# Altium schematic sheet 9 Microphone Input.SchDoc
size B; DocumentNumber: 9; SheetNumber: 9; SheetTotal: 17
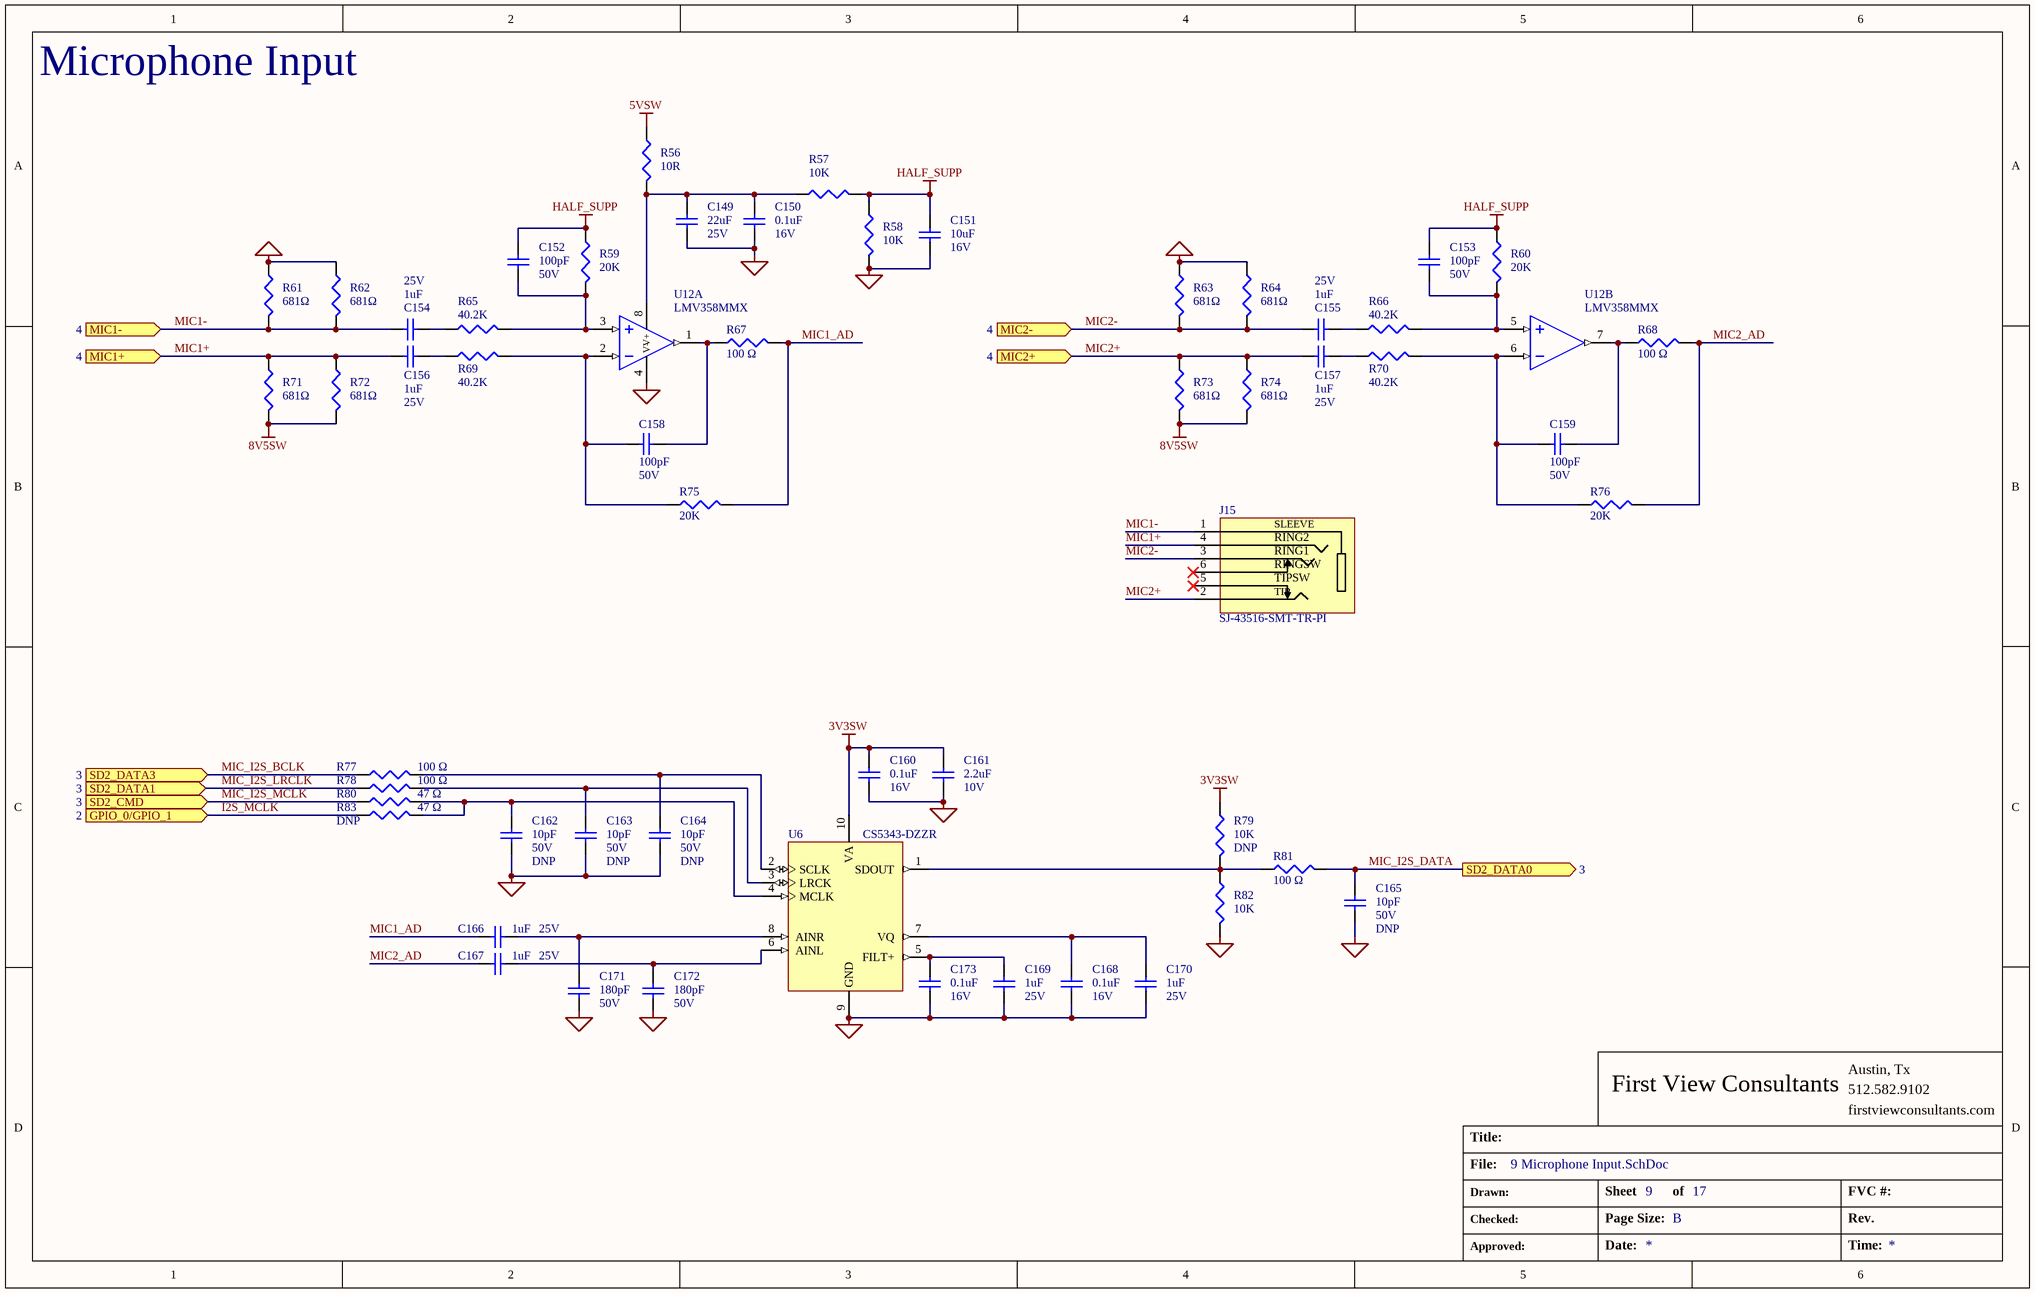
[diagram p0: 9 Microphone Input.SchDoc]

## Parts
C149  value 22uF  Voltage: 25V  [CAP_0805]  (hidden comment: Cap 22uF 25V 0805)
C150  value 0.1uF  Voltage: 16V  [CAP_0402]  (hidden comment: Cap 0.1uF 16V 0402)
C151  value 10uF  Voltage: 16V  [CAP_0603]  (hidden comment: Cap 10uF 16V 0603)
C152  value 100pF  Voltage: 50V  [CAP_0402]  (hidden comment: Cap 100pF 50V 0402)
C153  value 100pF  Voltage: 50V  [CAP_0402]  (hidden comment: Cap 100pF 50V 0402)
C154  value 1uF  Voltage: 25V  [CAP_0402]  (hidden comment: Cap 1uF 25V 0402)
C155  value 1uF  Voltage: 25V  [CAP_0402]  (hidden comment: Cap 1uF 25V 0402)
C156  value 1uF  Voltage: 25V  [CAP_0402]  (hidden comment: Cap 1uF 25V 0402)
C157  value 1uF  Voltage: 25V  [CAP_0402]  (hidden comment: Cap 1uF 25V 0402)
C158  value 100pF  Voltage: 50V  [CAP_0402]  (hidden comment: Cap 100pF 50V 0402)
C159  value 100pF  Voltage: 50V  [CAP_0402]  (hidden comment: Cap 100pF 50V 0402)
C160  value 0.1uF  Voltage: 16V  [CAP_0402]  (hidden comment: Cap 0.1uF 16V 0402)
C161  value 2.2uF  Voltage: 10V  [CAP_0402]  (hidden comment: Cap 2.2uF 10V 0402)
C162  value 10pF  Voltage: 50V  [CAP_0402]  (hidden comment: Cap 10pF 50V 0402)
C163  value 10pF  Voltage: 50V  [CAP_0402]  (hidden comment: Cap 10pF 50V 0402)
C164  value 10pF  Voltage: 50V  [CAP_0402]  (hidden comment: Cap 10pF 50V 0402)
C165  value 10pF  Voltage: 50V  [CAP_0402]  (hidden comment: Cap 10pF 50V 0402)
C166  value 1uF  Voltage: 25V  [CAP_0402]  (hidden comment: Cap 1uF 25V 0402)
C167  value 1uF  Voltage: 25V  [CAP_0402]  (hidden comment: Cap 1uF 25V 0402)
C168  value 0.1uF  Voltage: 16V  [CAP_0402]  (hidden comment: Cap 0.1uF 16V 0402)
C169  value 1uF  Voltage: 25V  [CAP_0402]  (hidden comment: Cap 1uF 25V 0402)
C170  value 1uF  Voltage: 25V  [CAP_0402]  (hidden comment: Cap 1uF 25V 0402)
C171  value 180pF  Voltage: 50V  [CAP_0402]  (hidden comment: Cap 180pF 50V 0402)
C172  value 180pF  Voltage: 50V  [CAP_0402]  (hidden comment: Cap 180pF 50V 0402)
C173  value 0.1uF  Voltage: 16V  [CAP_0402]  (hidden comment: Cap 0.1uF 16V 0402)
J15  SJ-43516-SMT-TR-PI  [CON_SJ-43516-SMT]
R56  value 10R  [RES_0402]  (hidden comment: Res 10R 0.1W)
R57  value 10K  [RES_0402]  (hidden comment: Res 10K 0.063W)
R58  value 10K  [RES_0402]  (hidden comment: Res 10K 0.063W)
R59  value 20K  [RES_0402]  (hidden comment: Res 20K 0.1W)
R60  value 20K  [RES_0402]  (hidden comment: Res 20K 0.1W)
R61  value 681Ω  [RES_1210]  (hidden comment: Res 681R 0.5W)
R62  value 681Ω  [RES_1210]  (hidden comment: Res 681R 0.5W)
R63  value 681Ω  [RES_1210]  (hidden comment: Res 681R 0.5W)
R64  value 681Ω  [RES_1210]  (hidden comment: Res 681R 0.5W)
R65  value 40.2K  [RES_0402]  (hidden comment: Res 40.2K 0.1W)
R66  value 40.2K  [RES_0402]  (hidden comment: Res 40.2K 0.1W)
R67  value 100 Ω  [RES_0402]  (hidden comment: Res 100R 0.063W)
R68  value 100 Ω  [RES_0402]  (hidden comment: Res 100R 0.063W)
R69  value 40.2K  [RES_0402]  (hidden comment: Res 40.2K 0.1W)
R70  value 40.2K  [RES_0402]  (hidden comment: Res 40.2K 0.1W)
R71  value 681Ω  [RES_1210]  (hidden comment: Res 681R 0.5W)
R72  value 681Ω  [RES_1210]  (hidden comment: Res 681R 0.5W)
R73  value 681Ω  [RES_1210]  (hidden comment: Res 681R 0.5W)
R74  value 681Ω  [RES_1210]  (hidden comment: Res 681R 0.5W)
R75  value 20K  [RES_0402]  (hidden comment: Res 20K 0.1W)
R76  value 20K  [RES_0402]  (hidden comment: Res 20K 0.1W)
R77  value 100 Ω  [RES_0402]  (hidden comment: Res 100R 0.063W)
R78  value 100 Ω  [RES_0402]  (hidden comment: Res 100R 0.063W)
R79  value 10K  [RES_0402]  (hidden comment: Res 10K 0.063W)
R80  value 47 Ω  [RES_0402]  (hidden comment: Res 47R 0.063W)
R81  value 100 Ω  [RES_0402]  (hidden comment: Res 100R 0.063W)
R82  value 10K  [RES_0402]  (hidden comment: Res 10K 0.063W)
R83  value 47 Ω  [RES_0402]  (hidden comment: Res 47R 0.063W)
U6  CS5343-DZZR  [TSSOP-10_CS5343]
U12  LMV358MMX  [VSSOP-8_LMV358MMX]  (parts A,B of 2)

## Ports
GPIO_0/GPIO_1 (in, see 2), MIC1+ (in, see 4), MIC1- (in, see 4), MIC2+ (in, see 4), MIC2- (in, see 4), SD2_CMD (in, see 3), SD2_DATA0 (out, see 3), SD2_DATA1 (in, see 3), SD2_DATA3 (in, see 3)

## Nets
3V3SW: C160.1 C161.1 R79.1 U6.10(VA)
5VSW: R56.1
8V5SW: R71.2 R72.2 R73.2 R74.2
GND: C149.2 C150.2 C151.2 C160.2 C161.2 C162.2 C163.2 C164.2 C165.2 C168.2 C169.2 C170.2 C171.2 C172.2 C173.2 R58.2 R61.1 R62.1 R63.1 R64.1 R82.2 U6.9(GND) U12.4(V-)
HALF_SUPP: C151.1 C152.1 C153.1 R57.2 R58.1 R59.1 R60.1
I2S_MCLK: R83.1 ; port GPIO_0/GPIO_1
MIC1+: C156.1 J15.4(RING_2) R71.1 R72.1 ; port MIC1+
MIC1-: C154.1 J15.1(SLEEVE) R61.2 R62.2 ; port MIC1-
MIC1_AD: C166.1 R67.2 R75.2
MIC2+: C157.1 J15.2(TIP) R73.1 R74.1 ; port MIC2+
MIC2-: C155.1 J15.3(RING_1) R63.2 R64.2 ; port MIC2-
MIC2_AD: C167.1 R68.2 R76.2
MIC_I2S_BCLK: R77.1 ; port SD2_DATA3
MIC_I2S_DATA: C165.1 R81.2 ; port SD2_DATA0
MIC_I2S_LRCLK: R78.1 ; port SD2_DATA1
MIC_I2S_MCLK: R80.1 ; port SD2_CMD
NetC149_1: C149.1 C150.1 R56.2 R57.1 U12.8(V+)
NetC152_2: C152.2 R59.2 R65.2 U12.3(INA+)
NetC153_2: C153.2 R60.2 R66.2 U12.5(INB+)
NetC154_2: C154.2 R65.1
NetC155_2: C155.2 R66.1
NetC156_2: C156.2 R69.1
NetC157_2: C157.2 R70.1
NetC158_1: C158.1 R69.2 R75.1 U12.2(INA-)
NetC158_2: C158.2 R67.1 U12.1(OUTA)
NetC159_1: C159.1 R70.2 R76.1 U12.6(INB-)
NetC159_2: C159.2 R68.1 U12.7(OUTB)
NetC162_1: C162.1 R80.2 R83.2 U6.4(MCLK)
NetC163_1: C163.1 R78.2 U6.3(LRCK)
NetC164_1: C164.1 R77.2 U6.2(SCLK)
NetC166_2: C166.2 C171.1 U6.8(AINR)
NetC167_2: C167.2 C172.1 U6.6(AINL)
NetC168_1: C168.1 C170.1 U6.7(VQ)
NetC169_1: C169.1 C173.1 U6.5(FILT+)
NetR79_2: R79.2 R81.1 R82.1 U6.1(SDOUT)

Not connected (* = marked no-connect by the designer): J15 5(TIP_SW)* 6(RING_SW)*

## Notes on the sheet
- Microphone Input
- First View Consultants
- Austin, Tx
- 512.582.9102
- Title:
- File:
- firstviewconsultants.com
- Drawn:
- Checked:
- Sheet
- Page Size:
- of
- B
- FVC #:
- Rev.
- Approved:
- Date:
- Time:
- (in symbol SJ-43516-SMT-TR-PI) RING2; RING1; RINGSW; TIPSW

## Library data of the parts
C149 = Cap 22uF 25V 0805: Cap, Cer, 22uF, 25V, 20%, X5R, 0805; Manufacturer #: CL21A226MAQNNNE; Manufacturer: Samsung Electro-Mechanics America, Inc; Have Footprint: yes; Tolerance: ±20%; Package: 0805
C150 C160 C168 C173 = Cap 0.1uF 16V 0402: Cap, Cer, 0.1uF, 16V, 10%, X7R, 0402; Manufacturer #: GRM155R71C104KA88D; Manufacturer: Murata Electronics North America; Have Footprint: yes; Package: 0402; Tolerance: ±10%
C151 = Cap 10uF 16V 0603: Cap, Cer, 10uF, 16V, 20%, X5R, 0603; Manufacturer #: GRM188C81C106MA73D; Manufacturer: Murata Electronics North America; Have Footprint: yes; RoHS: yes; Tolerance: ±20%; Operating Temperature: -55°C ~ 85°C; Package: 0603
C152 C153 C158 C159 = Cap 100pF 50V 0402: Cap, Cer, 100pF, 50V, 5%, C0G/NP0, 0402; Manufacturer: Yageo; Manufacturer #: CC0402JRNPO9BN101; Have Footprint: yes; Tolerance: 5%; PACKAGE: 0402
C154-C157 C166 C167 C169 C170 = Cap 1uF 25V 0402: Cap, Cer, 1uF, 25V, 10%, X5R, 0402; Manufacturer #: TMK105BJ105MV-F; Manufacturer: Taiyo Yuden; Have Footprint: yes; Package: 0402
C161 = Cap 2.2uF 10V 0402: Cap, Cer, 2.2uF, 10V, 10%, X5R, 0402; Manufacturer #: C0402C225M8PACTU; Manufacturer: Kemet; Have Footprint: yes; Package: 0402
C162-C165 = Cap 10pF 50V 0402: Cap, Cer, 10pF, 50V, 5%, C0G/NP0, 0402; Manufacturer #: CC0402JRNPO9BN100; Manufacturer: Yageo; Have Footprint: yes; PACKAGE: 0402; DNP: DNP; Operating Temperature: -55°C ~ 125°C; Tolerance: 5%
C171 C172 = Cap 180pF 50V 0402: Cap, Cer, 180pF, 50V, 5%, NP0, 0402; Manufacturer: Murata Electronics North America; Manufacturer #: GRM1555C1H181JA01J; Have Footprint: yes; Tolerance: 5%; PACKAGE: 0402
J15 = SJ-43516-SMT-TR-PI: Conn, Audio Jack, 3.5mm, Pink, SMD; Manufacturer: CUI Inc; Operating Temperature: -20°C ~ 85°C; Manufacturer #: SJ-43516-SMT-TR-PI
R56 = Res 10R 0.1W: Res, 10R, 0.1W, 0402; Manufacturer #: ERJ-2GEJ100X; Manufacturer: Panasonic Electronic Components; Have Footprint: yes; Package: 0402
R57 R58 R79 R82 = Res 10K 0.063W: Res, 10K, 1/16W, 1%, 0402; Manufacturer #: RC0402FR-0710KL; Manufacturer: Yageo; Have Footprint: yes; Package: 0402
  R79: DNP: DNP
R59 R60 R75 R76 = Res 20K 0.1W: Res, 20K, 0.1W, 1%, 0402; Manufacturer #: ERJ-2RKF2002X; Manufacturer: Panasonic Electronic Components; Have Footprint: yes; Package: 0402
R61-R64 R71-R74 = Res 681R 0.5W: Res, 681R, 0.5W, 1%, 1210; Manufacturer #: ERJ-14NF6810U; Manufacturer: Panasonic Electronic Components; Package: 1210; Operating Temperature: -55°C ~ 155°C; Tolerance: 1%
R65 R66 R69 R70 = Res 40.2K 0.1W: Res, 40.2K, 0.1W, 1%, 0402; Manufacturer #: ERJ-2RKF4022X; Manufacturer: Panasonic Electronic Components; Have Footprint: yes; Package: 0402
R67 R68 R77 R78 R81 = Res 100R 0.063W: Res, 100R, 0.063W, 1%, 0402; Manufacturer #: TRR01MZPF1000; Manufacturer: Murata Electronics North America; Have Footprint: yes; Package: 0402
R80 R83 = Res 47R 0.063W: Res, 47R, 0.063W, 5%, 0402; Manufacturer #: RMCF0402JT47R0; Manufacturer: Stackpole Electronics Inc; Have Footprint: yes; Package: 0402; Tolerance: 5%
  R83: DNP: DNP
U6 = CS5343-DZZR: IC, ADC, I2S, 98dB, Audio, TSSOP-10; Manufacturer: Cirrus Logic; Have Footprint: yes; RoHS: yes; Manufacturer #: CS5343-DZZR
U12 = LMV358MMX: IC, Dual Op Amp, 2.7-5V, VSSOP-8; Manufacturer: Texas Instruments; Have Footprint: yes; RoHS: yes; Manufacturer #: LMV358MMX